# Altium schematic sheet PWR_BRGwFilter.SchDoc
size A3; SheetNumber: 6; SheetTotal: 9
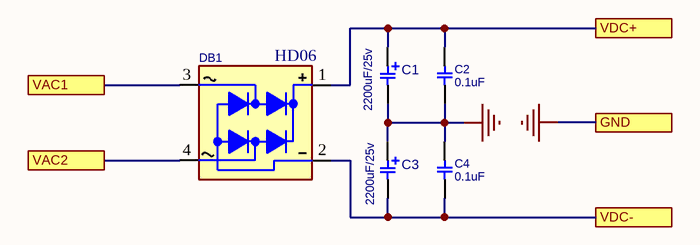
[diagram p0: PWR_BRGwFilter.SchDoc]

## Parts
C1  2200uF/25v  [C_EL_12X25]
C2  0.1uF  [C0603]
C3  2200uF/25v  [C_EL_12X25]
C4  0.1uF  [C0603]
DB1  HD06  [DBRG_DIPSMD_MINI]

## Ports
GND, VAC1, VAC2, VDC+, VDC-

## Nets
GND: C1.2 C2.1 C3.1 C4.2 ; port GND
VAC1: DB1.3(ACIN2) ; port VAC1
VAC2: DB1.4(ACIN1) ; port VAC2
VDC+: C1.1 C2.2 DB1.1(DCOUT+) ; port VDC+
VDC-: C3.2 C4.1 DB1.2(DCOUT-) ; port VDC-

## Library data of the parts
C1 C3 = CAP_THD_EL_12X25: CAP, THD, ELEC,; MANF_P#: MANF_PART#; PARAM2: 25V; DESC: DESCRIPTION; DIST#: MOUSER; PARAM: 20%; PRICE: 10= 5$; MANF: MANF; ASSEMBLY: ASSEMBLY; VALUE: 2200uF/25v
C2 C4 = CAP_SMD_MLCC_0805: CAP, MLCC, -F, -V, MATERIAL, -%, 0201; PARAM: -, -%; MANF_P#: MANF_PART#; PRICE: 100= 1$; MANF: -; PARAM2: -V; ASSEMBLY: ASSEMBLY; VALUE: 0.1uF
DB1 = DIODE_SMD_BRIDGE_HD06: DIODE, BRIDGE,; PARAM2: 600v; PARAM: 0.5A; MANF_P#: HD06; VALUE: HD06